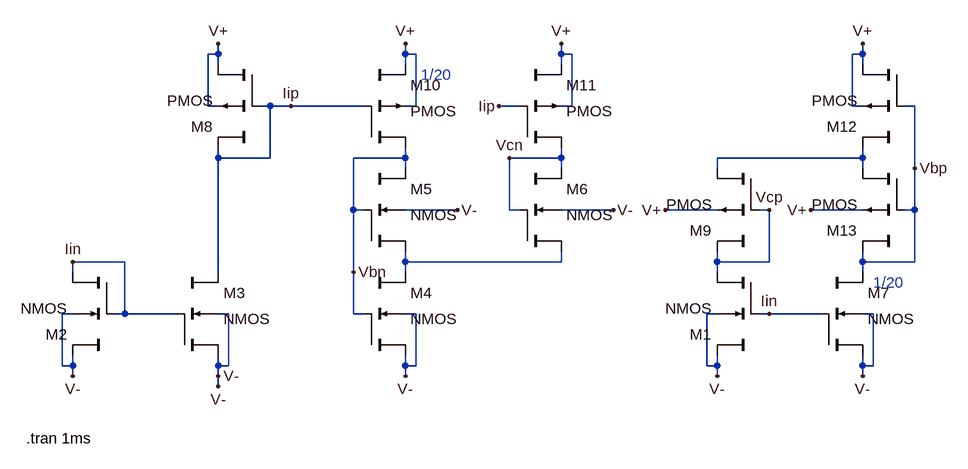
[diagram p0: schematic Bias.asc]
Bias.asc, the LTspice schematic file:
Version 4
SHEET 1 880 680
WIRE -752 -240 -752 -256
WIRE -752 -240 -768 -240
WIRE -464 -240 -464 -256
WIRE -448 -240 -464 -240
WIRE -224 -240 -224 -256
WIRE -208 -240 -224 -240
WIRE 240 -240 240 -256
WIRE 240 -240 224 -240
WIRE -752 -224 -752 -240
WIRE -464 -224 -464 -240
WIRE -224 -224 -224 -240
WIRE 240 -224 240 -240
WIRE -768 -160 -768 -240
WIRE -752 -160 -768 -160
WIRE -672 -160 -688 -160
WIRE -640 -160 -672 -160
WIRE -528 -160 -640 -160
WIRE -448 -160 -448 -240
WIRE -448 -160 -464 -160
WIRE -288 -160 -320 -160
WIRE -208 -160 -208 -240
WIRE -208 -160 -224 -160
WIRE 224 -160 224 -240
WIRE 240 -160 224 -160
WIRE 320 -160 304 -160
WIRE -752 -80 -752 -96
WIRE -672 -80 -672 -160
WIRE -672 -80 -752 -80
WIRE -464 -80 -464 -96
WIRE -464 -80 -544 -80
WIRE -224 -80 -224 -96
WIRE -224 -80 -304 -80
WIRE 240 -80 240 -96
WIRE 240 -80 16 -80
WIRE -464 -64 -464 -80
WIRE -224 -64 -224 -80
WIRE 16 -64 16 -80
WIRE 240 -64 240 -80
WIRE 320 -64 320 -160
WIRE -544 0 -544 -80
WIRE -528 0 -544 0
WIRE -384 0 -464 0
WIRE -304 0 -304 -80
WIRE -288 0 -304 0
WIRE -144 0 -224 0
WIRE 16 0 -64 0
WIRE 96 0 80 0
WIRE 240 0 160 0
WIRE 320 0 320 -64
WIRE 320 0 304 0
WIRE -896 80 -976 80
WIRE -464 80 -464 64
WIRE -224 80 -224 64
WIRE -224 80 -464 80
WIRE 16 80 16 64
WIRE 96 80 96 0
WIRE 96 80 16 80
WIRE 240 80 240 64
WIRE 320 80 320 0
WIRE 320 80 240 80
WIRE -976 96 -976 80
WIRE -752 96 -752 -80
WIRE -544 96 -544 0
WIRE -464 96 -464 80
WIRE 16 96 16 80
WIRE 240 96 240 80
WIRE -976 160 -992 160
WIRE -896 160 -896 80
WIRE -896 160 -912 160
WIRE -816 160 -896 160
WIRE -736 160 -752 160
WIRE -544 160 -544 96
WIRE -528 160 -544 160
WIRE -448 160 -464 160
WIRE 16 160 0 160
WIRE 96 160 80 160
WIRE 176 160 96 160
WIRE 256 160 240 160
WIRE -992 240 -992 160
WIRE -976 240 -976 224
WIRE -976 240 -992 240
WIRE -752 240 -752 224
WIRE -736 240 -736 160
WIRE -736 240 -752 240
WIRE -464 240 -464 224
WIRE -448 240 -448 160
WIRE -448 240 -464 240
WIRE 0 240 0 160
WIRE 16 240 16 224
WIRE 16 240 0 240
WIRE 240 240 240 224
WIRE 256 240 256 160
WIRE 256 240 240 240
WIRE -976 256 -976 240
WIRE -752 256 -752 240
WIRE -464 256 -464 240
WIRE 16 256 16 240
WIRE 240 256 240 240
WIRE -752 272 -752 256
FLAG -752 -256 V+
FLAG -464 -256 V+
FLAG -224 -256 V+
FLAG -752 272 V-
FLAG -976 256 V-
FLAG -752 256 V-
FLAG -464 256 V-
FLAG 16 256 V-
FLAG 240 256 V-
FLAG -144 0 V-
FLAG -384 0 V-
FLAG -64 0 V+
FLAG 240 -256 V+
FLAG 160 0 V+
FLAG -304 -80 Vcn
FLAG 96 0 Vcp
FLAG -544 96 Vbn
FLAG 320 -64 Vbp
FLAG -976 80 Iin
FLAG 96 160 Iin
FLAG -640 -160 Iip
FLAG -320 -160 Iip
SYMBOL cktsym\\nmos4 16 160 R180
SYMATTR InstName M1
SYMATTR Value2 l=1.8um w=36um
SYMBOL cktsym\\nmos4 -976 160 R180
SYMATTR InstName M2
SYMATTR Value2 l=1.8um w=36um
SYMBOL cktsym\\nmos4 -752 160 R0
SYMATTR InstName M3
SYMATTR Value2 l=1.8um w=36um
SYMBOL cktsym\\nmos4 -464 160 R0
SYMATTR InstName M4
SYMATTR Value2 l=1.8um w=36um
SYMBOL cktsym\\nmos4 -464 0 R0
SYMATTR InstName M5
SYMATTR Value2 l=1.8um w=36um
SYMBOL cktsym\\nmos4 -224 0 R0
SYMATTR InstName M6
SYMATTR Value2 l=1.8um w=36um
SYMBOL cktsym\\nmos4 240 160 R0
SYMATTR InstName M7
SYMATTR Value2 l=1.8um w=1.8um
SYMBOL cktsym\\pmos4 -752 -160 R180
SYMATTR InstName M8
SYMATTR Value2 l=1.8um w=36um
SYMBOL cktsym\\pmos4 16 0 R180
SYMATTR InstName M9
SYMATTR Value2 l=1.8um w=36um
SYMBOL cktsym\\pmos4 -464 -160 R0
SYMATTR InstName M10
SYMATTR Value2 l=1.8um w=1.8um
SYMBOL cktsym\\pmos4 -224 -160 R0
SYMATTR InstName M11
SYMATTR Value2 l=1.8um w=36um
SYMBOL cktsym\\pmos4 240 -160 R180
SYMATTR InstName M12
SYMATTR Value2 l=1.8um w=36um
SYMBOL cktsym\\pmos4 240 0 R180
SYMATTR InstName M13
SYMATTR Value2 l=1.8um w=36um
TEXT -440 -208 Left 2 ;1/20
TEXT 256 112 Left 2 ;1/20
TEXT -1048 352 Left 2 !.tran 1ms

The netlist it stands for:
* Bias.asc
M1 V- Iin Vcp V- NMOS l=1.8um w=36um
M2 V- Iin Iin V- NMOS l=1.8um w=36um
M3 Iip Iin V- V- NMOS l=1.8um w=36um
M4 N002 Vbn V- V- NMOS l=1.8um w=36um
M5 Vbn Vbn N002 V- NMOS l=1.8um w=36um
M6 Vcn Vcn N002 V- NMOS l=1.8um w=36um
M7 Vbp Iin V- V- NMOS l=1.8um w=1.8um
M8 V+ Iip Iip V+ PMOS l=1.8um w=36um
M9 N001 Vcp Vcp V+ PMOS l=1.8um w=36um
M10 Vbn Iip V+ V+ PMOS l=1.8um w=1.8um
M11 Vcn Iip V+ V+ PMOS l=1.8um w=36um
M12 V+ Vbp N001 V+ PMOS l=1.8um w=36um
M13 N001 Vbp Vbp V+ PMOS l=1.8um w=36um
.model NMOS NMOS
.model PMOS PMOS
.lib standard.mos
* 1/20
* 1/20
.tran 1ms
.backanno
.end